# EAGLE schematic HPCTL Schematic (EAGLE 9.7.0)
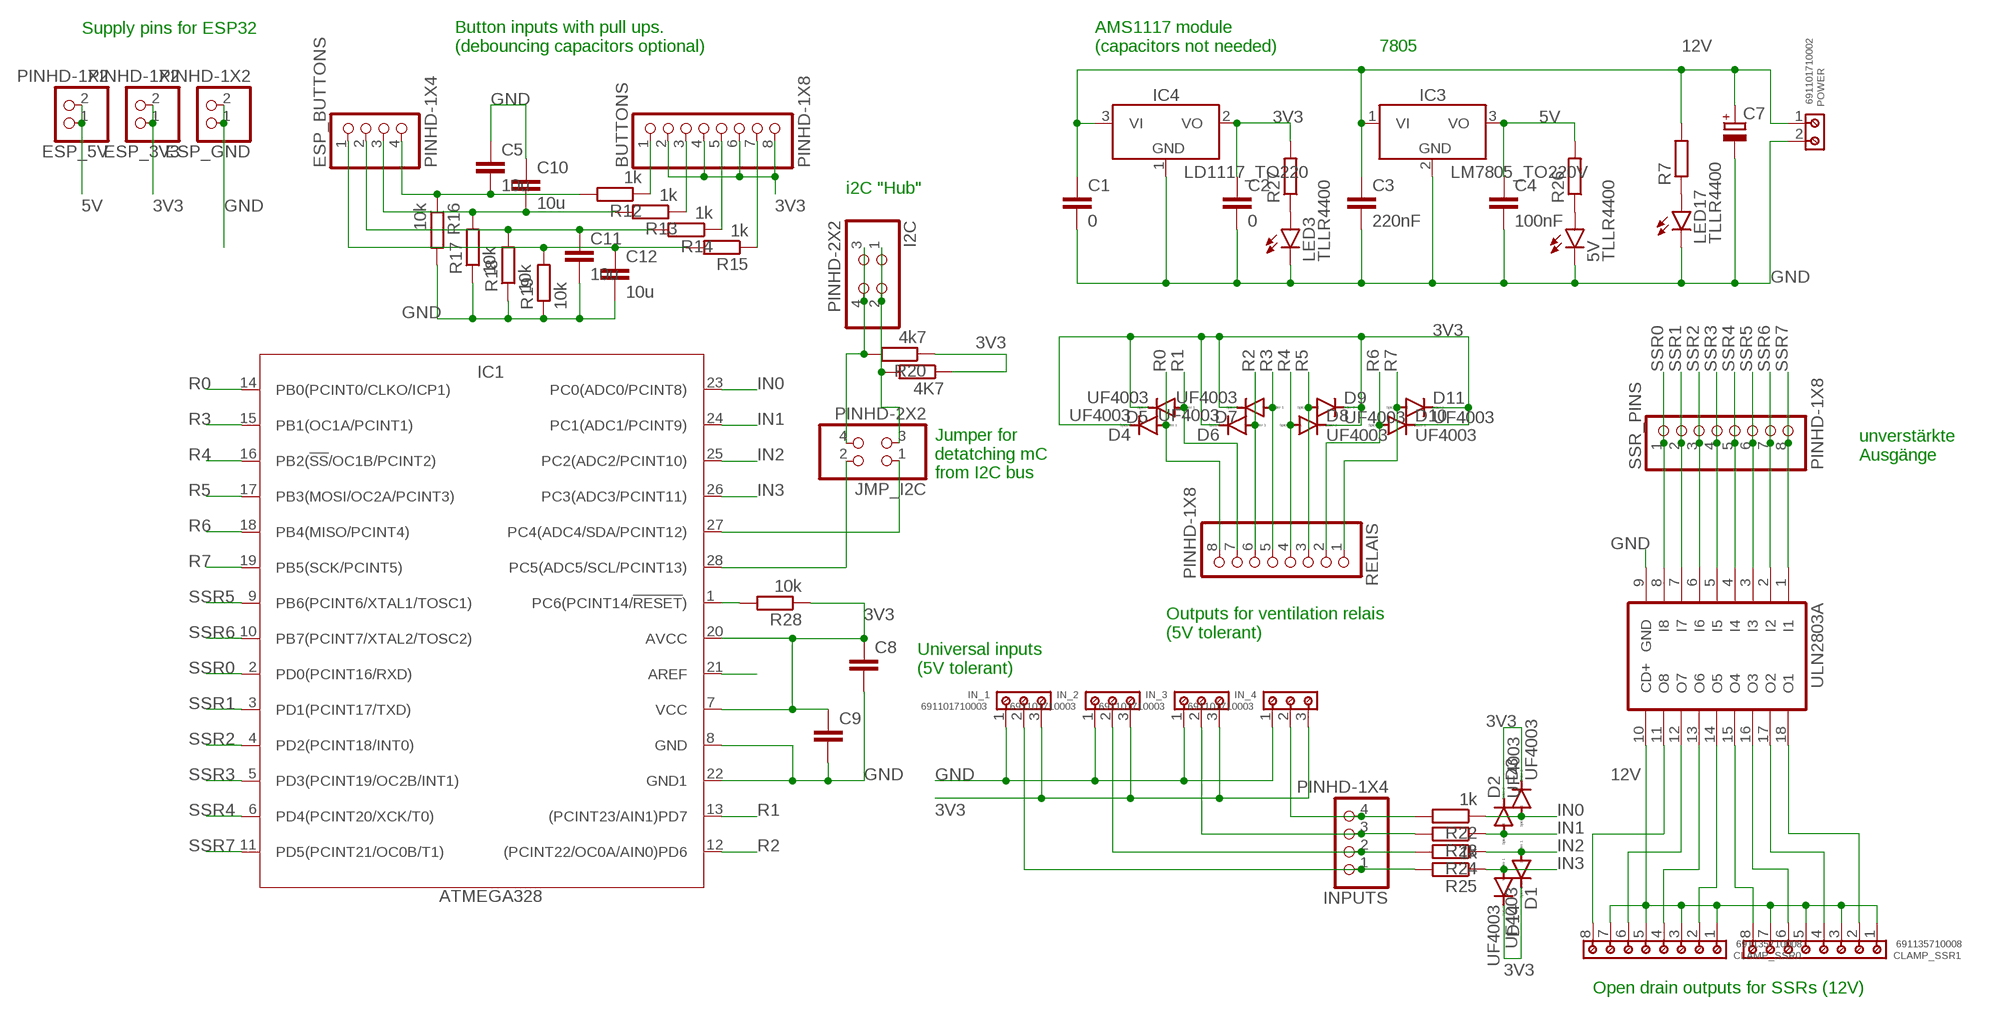
[diagram p0: schematic, sheet 1]

## Parts
4K7  R-EU_0207/10  [0207/10]
5V  TLLR4400  [LED3MM]
BUTTONS  PINHD-1X8  [1X08]
C1  0  C-EUC0805K  [C0805K]
C2  0  C-EUC0805K  [C0805K]
C3  220nF  C-EUC0805K  [C0805K]
C4  100nF  C-EUC0805K  [C0805K]
C5  10u  C-EUC0805K  [C0805K]
C7  CPOL-EUE2-5  [E2-5]
C8  C-EUC0805K  [C0805K]
C9  C-EUC0805K  [C0805K]
C10  10u  C-EUC0805K  [C0805K]
C11  10u  C-EUC0805K  [C0805K]
C12  10u  C-EUC0805K  [C0805K]
CLAMP_SSR0  691135710008  691135710008  [691135710008]
CLAMP_SSR1  691135710008  691135710008  [691135710008]
D1  UF4003  [DO41-10]
D2  UF4003  [DO41-10]
D3  UF4003  [DO41-10]
D4  UF4003  [DO41-10]
D5  UF4003  [DO41-10]
D6  UF4003  [DO41-10]
D7  UF4003  [DO41-10]
D8  UF4003  [DO41-10]
D9  UF4003  [DO41-10]
D10  UF4003  [DO41-10]
D11  UF4003  [DO41-10]
D14  UF4003  [DO41-10]
ESP_3V3  PINHD-1X2  [1X02]
ESP_5V  PINHD-1X2  [1X02]
ESP_BUTTONS  PINHD-1X4  [1X04]
ESP_GND  PINHD-1X2  [1X02]
I2C  PINHD-2X2  [2X02]
IC1  ATMEGA328  ATMEGA328_DIP  [DIP1016W53P254L3467H457Q28B]
IC3  LM7805_TO220V  [TO220V]
IC4  LD1117_TO220  [TO220V]
IN_1  691101710003  691101710003  [691101710003]
IN_2  691101710003  691101710003  [691101710003]
IN_3  691101710003  691101710003  [691101710003]
IN_4  691101710003  691101710003  [691101710003]
INPUTS  PINHD-1X4  [1X04]
JMP_I2C  PINHD-2X2  [2X02]
LED3  TLLR4400  [LED3MM]
LED17  TLLR4400  [LED3MM]
POWER  691101710002  691101710002  [691101710002]
R7  R-EU_0207/10  [0207/10]
R12  1k  R-EU_0207/10  [0207/10]
R13  1k  R-EU_0207/10  [0207/10]
R14  1k  R-EU_0207/10  [0207/10]
R15  1k  R-EU_0207/10  [0207/10]
R16  10k  R-EU_0207/10  [0207/10]
R17  10k  R-EU_0207/10  [0207/10]
R18  10k  R-EU_0207/10  [0207/10]
R19  10k  R-EU_0207/10  [0207/10]
R20  4k7  R-EU_0207/10  [0207/10]
R22  1k  R-EU_0207/10  [0207/10]
R23  R-EU_0207/10  [0207/10]
R24  R-EU_0207/10  [0207/10]
R25  1k  R-EU_0207/10  [0207/10]
R26  R-EU_0207/10  [0207/10]
R27  R-EU_0207/10  [0207/10]
R28  10k  R-EU_0207/10  [0207/10]
RELAIS  PINHD-1X8  [1X08]
SSR_PINS  PINHD-1X8  [1X08]
ULN2803A  ULN2804A  [DIL18]

## Nets
3V3: 4K7.1 BUTTONS.2 BUTTONS.4 BUTTONS.6 BUTTONS.8 C2.1 C8.1 C9.1 D1.C D2.C D3.C D4.C D5.C D6.C D7.C D8.C D9.C D10.C D11.C D14.C ESP_3V3.1 ESP_3V3.2 IC1.7(VCC) IC1.20(AVCC) IC4.2(VO) IN_1.3 IN_2.3 IN_3.3 IN_4.3 R20.1 R27.2 R28.1
5V: C4.1 ESP_5V.1 ESP_5V.2 IC3.3(VO) R26.2
12V: C1.1 C3.1 C7.+ CLAMP_SSR0.1 CLAMP_SSR0.3 CLAMP_SSR0.5 CLAMP_SSR0.7 CLAMP_SSR1.1 CLAMP_SSR1.3 CLAMP_SSR1.5 CLAMP_SSR1.7 IC3.1(VI) IC4.3(VI) POWER.1 R7.2 ULN2803A.10(CD+)
GND: 5V.K(C) C1.2 C2.2 C3.2 C4.2 C5.1 C7.- C8.2 C9.2 C10.1 C11.2 C12.2 ESP_GND.1 ESP_GND.2 IC1.8(GND) IC1.22(GND1) IC3.2(GND) IC4.1(GND) IN_1.1 IN_2.1 IN_3.1 IN_4.1 LED3.K(C) LED17.K(C) POWER.2 R16.2 R17.1 R18.1 R19.1 ULN2803A.9(GND)
IN0: D3.A IC1.23(PC0(ADC0/PCINT8)) R22.1
IN1: D2.A IC1.24(PC1(ADC1/PCINT9)) R23.1
IN2: D1.A IC1.25(PC2(ADC2/PCINT10)) R24.1
IN3: D14.A IC1.26(PC3(ADC3/PCINT11)) R25.1
N$1: I2C.3 I2C.4 JMP_I2C.4 R20.2
N$2: 4K7.2 I2C.1 I2C.2 JMP_I2C.3
N$5: BUTTONS.7 R15.1
N$6: BUTTONS.5 R14.1
N$7: BUTTONS.3 R13.1
N$8: BUTTONS.1 R12.1
N$9: LED17.A R7.1
N$18: CLAMP_SSR0.8 ULN2803A.11(O8)
N$19: CLAMP_SSR0.6 ULN2803A.12(O7)
N$20: CLAMP_SSR0.4 ULN2803A.13(O6)
N$21: CLAMP_SSR0.2 ULN2803A.14(O5)
N$22: CLAMP_SSR1.8 ULN2803A.15(O4)
N$23: CLAMP_SSR1.6 ULN2803A.16(O3)
N$24: CLAMP_SSR1.4 ULN2803A.17(O2)
N$25: CLAMP_SSR1.2 ULN2803A.18(O1)
N$34: C5.2 ESP_BUTTONS.4 R12.2 R16.1
N$35: C12.1 ESP_BUTTONS.1 R15.2 R19.2
N$36: C11.1 ESP_BUTTONS.2 R14.2 R18.2
N$37: IN_4.2 INPUTS.4 R22.2
N$38: C10.2 ESP_BUTTONS.3 R13.2 R17.2
N$39: IN_3.2 INPUTS.3 R23.2
N$40: IN_2.2 INPUTS.2 R24.2
N$41: IN_1.2 INPUTS.1 R25.2
N$43: IC1.21(AREF)
N$46: 5V.A R26.1
N$47: LED3.A R27.1
N$50: IC1.1(PC6(PCINT14/!RESET!)) R28.2
R0: D4.A IC1.14(PB0(PCINT0/CLKO/ICP1)) RELAIS.8
R1: D5.A IC1.13((PCINT23/AIN1)PD7) RELAIS.7
R2: D6.A IC1.12((PCINT22/OC0A/AIN0)PD6) RELAIS.6
R3: D7.A IC1.15(PB1(OC1A/PCINT1)) RELAIS.5
R4: D8.A IC1.16(PB2(!SS!/OC1B/PCINT2)) RELAIS.4
R5: D9.A IC1.17(PB3(MOSI/OC2A/PCINT3)) RELAIS.3
R6: D10.A IC1.18(PB4(MISO/PCINT4)) RELAIS.2
R7: D11.A IC1.19(PB5(SCK/PCINT5)) RELAIS.1
SCL: IC1.28(PC5(ADC5/SCL/PCINT13)) JMP_I2C.2
SDA: IC1.27(PC4(ADC4/SDA/PCINT12)) JMP_I2C.1
SSR0: IC1.2(PD0(PCINT16/RXD)) SSR_PINS.1 ULN2803A.8(I8)
SSR1: IC1.3(PD1(PCINT17/TXD)) SSR_PINS.2 ULN2803A.7(I7)
SSR2: IC1.4(PD2(PCINT18/INT0)) SSR_PINS.3 ULN2803A.6(I6)
SSR3: IC1.5(PD3(PCINT19/OC2B/INT1)) SSR_PINS.4 ULN2803A.5(I5)
SSR4: IC1.6(PD4(PCINT20/XCK/T0)) SSR_PINS.5 ULN2803A.4(I4)
SSR5: IC1.9(PB6(PCINT6/XTAL1/TOSC1)) SSR_PINS.6 ULN2803A.3(I3)
SSR6: IC1.10(PB7(PCINT7/XTAL2/TOSC2)) SSR_PINS.7 ULN2803A.2(I2)
SSR7: IC1.11(PD5(PCINT21/OC0B/T1)) SSR_PINS.8 ULN2803A.1(I1)

## Notes on the sheet
- Supply pins for ESP32
- Button inputs with pull ups.
  (debouncing capacitors optional)
- AMS1117 module
  (capacitors not needed)
- 7805
- i2C "Hub"
- unverstärkte
  Ausgänge
- Jumper for
  detatching mC
  from I2C bus
- Outputs for ventilation relais
  (5V tolerant)
- Universal inputs
  (5V tolerant)
- Open drain outputs for SSRs (12V)

## Library data of the parts
4K7 R7 R12-R20 R22-R28 = rcl:R-EU_: RESISTOR, European symbol; SPICEPREFIX: R
5V LED3 LED17 = led:TLLR4400: Low Current (2mA) LED 3 mm Tinted Diffused Package color RED Source: Data sheet <http://www.farnell.com/datasheets/391100.pdf>; MF: VISHAY SEMICONDUCTOR; OC_FARNELL: 1612437
BUTTONS RELAIS SSR_PINS = Connector:PINHD-1X8: PIN HEADER; CATEGORY: CONNECTOR; SUB-CATEGORY: PIN-HEADER
C1-C5 C8-C12 = rcl:C-EU: CAPACITOR, European symbol; SPICEPREFIX: C
C7 = rcl:CPOL-EU: POLARIZED CAPACITOR, European symbol; SPICEPREFIX: C
CLAMP_SSR0 CLAMP_SSR1 = Wurth_Connectors_WR-TBL Wire Protector:691135710008: WR-TBL Serie 1357- 5.00 mm Horizontal Cable Entry w. Pressure Clamp KIND PROPERTIES Pitch 5 mm MATERIAL PROPERTIES Insulator Material PC Insulator Flammability Rating UL94 V-0 Insulator Color Grey Contact Material Copper Alloy Contact Plating Nickel over Tin Terminal Screw Material Steel Terminal Screw Plating Zinc Wire Guard Material Copper Alloy GENERAL INFORMATION Operating Temperature -30 up to +120 °C Compliance Lead free / RoHS ELECTRICAL PROPERTIES IR UL 14 A IR VDE 13.5 A Working Voltage [UL] 300 V (AC) Working Voltage [VDE] 250 V (AC) Withstanding Voltage [UL] 1600 V (AC) Withstanding Voltage [cULus] 2000 V (AC) Withstanding Voltage [VDE] 2000 V (AC) Contact Resistance 20 mΩ Contact Resistance [UL] 20 mΩ Contact Resistance [VDE] 20 mΩ MECHANICAL PROPERTIES Wire Strip Length 6 (mm) Screw M2.5 Solid Wire Section (AWG) 30 to 14 (AWG) Solid Wire Section (Metric) 0.05 to 2.08 (mm²) Stranded Wire Section (AWG) 30 to 14 (AWG) Stranded Wire Section (Metric) 0.05 to 2.08 (mm²) CERTIFICATION UL Approval E150931 CAT N: CZI (2) VDE Approval 40021362 VDE Approval 40021362 TYPE: CZI PACKAGING PROPERTIES Packaging Box <https://katalog.we-online.com/media/images/v2/o32801v209%20Family_WR-TBL1_Series1357.jpg> Details see: https://katalog.we-online.com/en/em/TBL_5_00_1357_HORIZONTAL_ENTRY_W_PRESSURE_CLAMP_69113571000x Updated by Ella Wu 2019-11-08 2019(C) Wurth Elektronik; DATASHEET-URL: https://www.we-online.com/catalog/datasheet/691135710008.pdf; IR-UL: 14A; IR-VDE: 13.5A; MOUNT: THT; PART-NUMBER: 691135710008; PINS: 8; PITCH: 5mm; TYPE: Horizontal; WIRE: 30 to 14 (AWG) 0.05 to 2.08 (mm²); WORKING-VOLTAGE-UL: 300V(AC); WORKING-VOLTAGE-VDE: 250V(AC)
D1-D11 D14 = diode:UF4003: DIODE ultrafast recovery diode, 200 V rectifier
ESP_3V3 ESP_5V ESP_GND = Connector:PINHD-1X2: PIN HEADER; CATEGORY: Headers; DESCRIPTION: Header, Straight, 2 Position; MANUFACTURER: Generic; MPN: Generic; OPERATING_TEMPERATURE: Generic; PART_STATUS: Active; PITCH: 0.100" (2.54mm); ROHS_COMPLIANCE: Generic; SERIES: Generic; SUB-CATEGORY: Headers, Male Pins; TYPE: Board to Board or Cable, Unshrouded, Through Hole, Straight
ESP_BUTTONS INPUTS = Connector:PINHD-1X4: PIN HEADER; CATEGORY: CONNECTOR; SUB-CATEGORY: PIN-HEADER
I2C JMP_I2C = Connector:PINHD-2X2: PIN HEADER; CATEGORY: CONNECTOR; SUB-CATEGORY: PIN-HEADER
IC1 = IC_Embedded:ATMEGA328: 8-bit AVR Microcontroller with 32K Bytes In-System Programmable Flash Datasheet <http://ww1.microchip.com/downloads/en/DeviceDoc/ATmega48A-PA-88A-PA-168A-PA-328-P-DS-DS40002061A.pdf>; CATEGORY: IC_Embedded; MANUFACTURER: Microchip Technologies; MPN: ATmega328-PN; OPERATING_TEMP: –40 to +105°C; PART_STATUS: Active; SUB-CATEGORY: Microcontroller
IC3 = IC_Power-Management:LM7805: 5V Voltage Regulator Reference Datasheet <https://www.ti.com/lit/ds/symlink/lm340.pdf>; CATEGORY: IC_Linear; DESCRIPTION: 5V Voltage Regulator; MANUFACTURER: Generic; MPN: Generic; SERIES: LM7805; SUB-CATEGORY: Voltage Regulator; TYPE: 5V
IC4 = IC_Power-Management:LD1117: Adjustable and fixed positive voltage regulator Reference Datasheet <https://www.st.com/content/ccc/resource/technical/document/datasheet/99/3b/7d/91/91/51/4b/be/CD00000544.pdf/files/CD00000544.pdf/jcr:content/translations/en.CD00000544.pdf>; CATEGORY: IC_Linear; DESCRIPTION: Adjustable voltage regulator; MANUFACTURER: STMicroelectronics; MPN: Generic; SERIES: LM1117; SUB-CATEGORY: Voltage Regulator; TYPE: Linear
IN_1-IN_4 = Wurth_Connectors_WR-TBL Wire Protector:691101710003: WR-TBL Serie 101 - 5.00 mm Horiz. Entry Modular KIND PROPERTIES Pitch 5 mm MATERIAL PROPERTIES Insulator Material PA66 Insulator Flammability Rating UL94 V-0 Insulator Color Blue Contact Material Brass Contact Plating Copper over Zinc Terminal Screw Material Steel Terminal Screw Plating Zinc Wire Guard Material Stainless Steel GENERAL INFORMATION Operating Temperature -40 up to +105 °C Compliance Lead free / RoHS ELECTRICAL PROPERTIES IR UL 16 A IR VDE 16 A Working Voltage [UL] 250 V (AC) Working Voltage [VDE] 250 V (AC) Withstanding Voltage [UL] 1500 V (AC) Withstanding Voltage [cULus] 2000 V (AC) Withstanding Voltage [VDE] 2000 V (AC) Contact Resistance [UL] 20 mΩ Contact Resistance [cULus] 20 mΩ Contact Resistance [VDE] 20 mΩ MECHANICAL PROPERTIES Wire Strip Length 6 up to 7 (mm) Screw M3 Solid Wire Section (AWG) 26 to 14 (AWG) Solid Wire Section (Metric) 0.129 to 2.08 (mm²) Stranded Wire Section (AWG) 26 to 14 (AWG) Stranded Wire Section (Metric) 0.129 to 2.08 (mm²) CERTIFICATION UL Approval E315414 VDE Approval 40022614 PACKAGING PROPERTIES Packaging Box <https://katalog.we-online.com/media/images/v2/o33380v209%20Family_WR_TBL_691101710002.jpg> Details see: https://katalog.we-online.com/en/em/TBL_5_00_101_6911017100XX Updated by Ella Wu 2019-11-07 2019(C) Wurth Elektronik; DATASHEET-URL: https://www.we-online.com/catalog/datasheet/691101710003.pdf; IR-UL: 16A; IR-VDE: 16A; MOUNT: THT; PART-NUMBER: 691101710003; PINS: 3; PITCH: 5mm; TYPE: Horizontal; WIRE: 26 to 14 (AWG) 0.129 to 2.08 (mm²); WORKING-VOLTAGE-UL: 250V(AC); WORKING-VOLTAGE-VDE: 250V(AC)
POWER = Wurth_Connectors_WR-TBL Wire Protector:691101710002: WR-TBL Serie 101 - 5.00 mm Horiz. Entry Modular KIND PROPERTIES Pitch 5 mm MATERIAL PROPERTIES Insulator Material PA66 Insulator Flammability Rating UL94 V-0 Insulator Color Blue Contact Material Brass Contact Plating Copper over Zinc Terminal Screw Material Steel Terminal Screw Plating Zinc Wire Guard Material Stainless Steel GENERAL INFORMATION Operating Temperature -40 up to +105 °C Compliance Lead free / RoHS ELECTRICAL PROPERTIES IR UL 16 A IR VDE 16 A Working Voltage [UL] 250 V (AC) Working Voltage [VDE] 250 V (AC) Withstanding Voltage [UL] 1500 V (AC) Withstanding Voltage [cULus] 2000 V (AC) Withstanding Voltage [VDE] 2000 V (AC) Contact Resistance [UL] 20 mΩ Contact Resistance [cULus] 20 mΩ Contact Resistance [VDE] 20 mΩ MECHANICAL PROPERTIES Wire Strip Length 6 up to 7 (mm) Screw M3 Solid Wire Section (AWG) 26 to 14 (AWG) Solid Wire Section (Metric) 0.129 to 2.08 (mm²) Stranded Wire Section (AWG) 26 to 14 (AWG) Stranded Wire Section (Metric) 0.129 to 2.08 (mm²) CERTIFICATION UL Approval E315414 VDE Approval 40022614 PACKAGING PROPERTIES Packaging Box <https://katalog.we-online.com/media/images/v2/o33380v209%20Family_WR_TBL_691101710002.jpg> Details see: https://katalog.we-online.com/en/em/TBL_5_00_101_6911017100XX Updated by Ella Wu 2019-11-07 2019(C) Wurth Elektronik; DATASHEET-URL: https://www.we-online.com/catalog/datasheet/691101710002.pdf; IR-UL: 16A; IR-VDE: 16A; MOUNT: THT; PART-NUMBER: 691101710002; PINS: 2; PITCH: 5mm; TYPE: Horizontal; WIRE: 26 to 14 (AWG) 0.129 to 2.08 (mm²); WORKING-VOLTAGE-UL: 250V(AC); WORKING-VOLTAGE-VDE: 250V(AC)
ULN2803A = uln-udn:ULN2804A: DRIVER ARRAY